# Altium project IR_SCOOTER.PrjPcb (part 1 of 4)
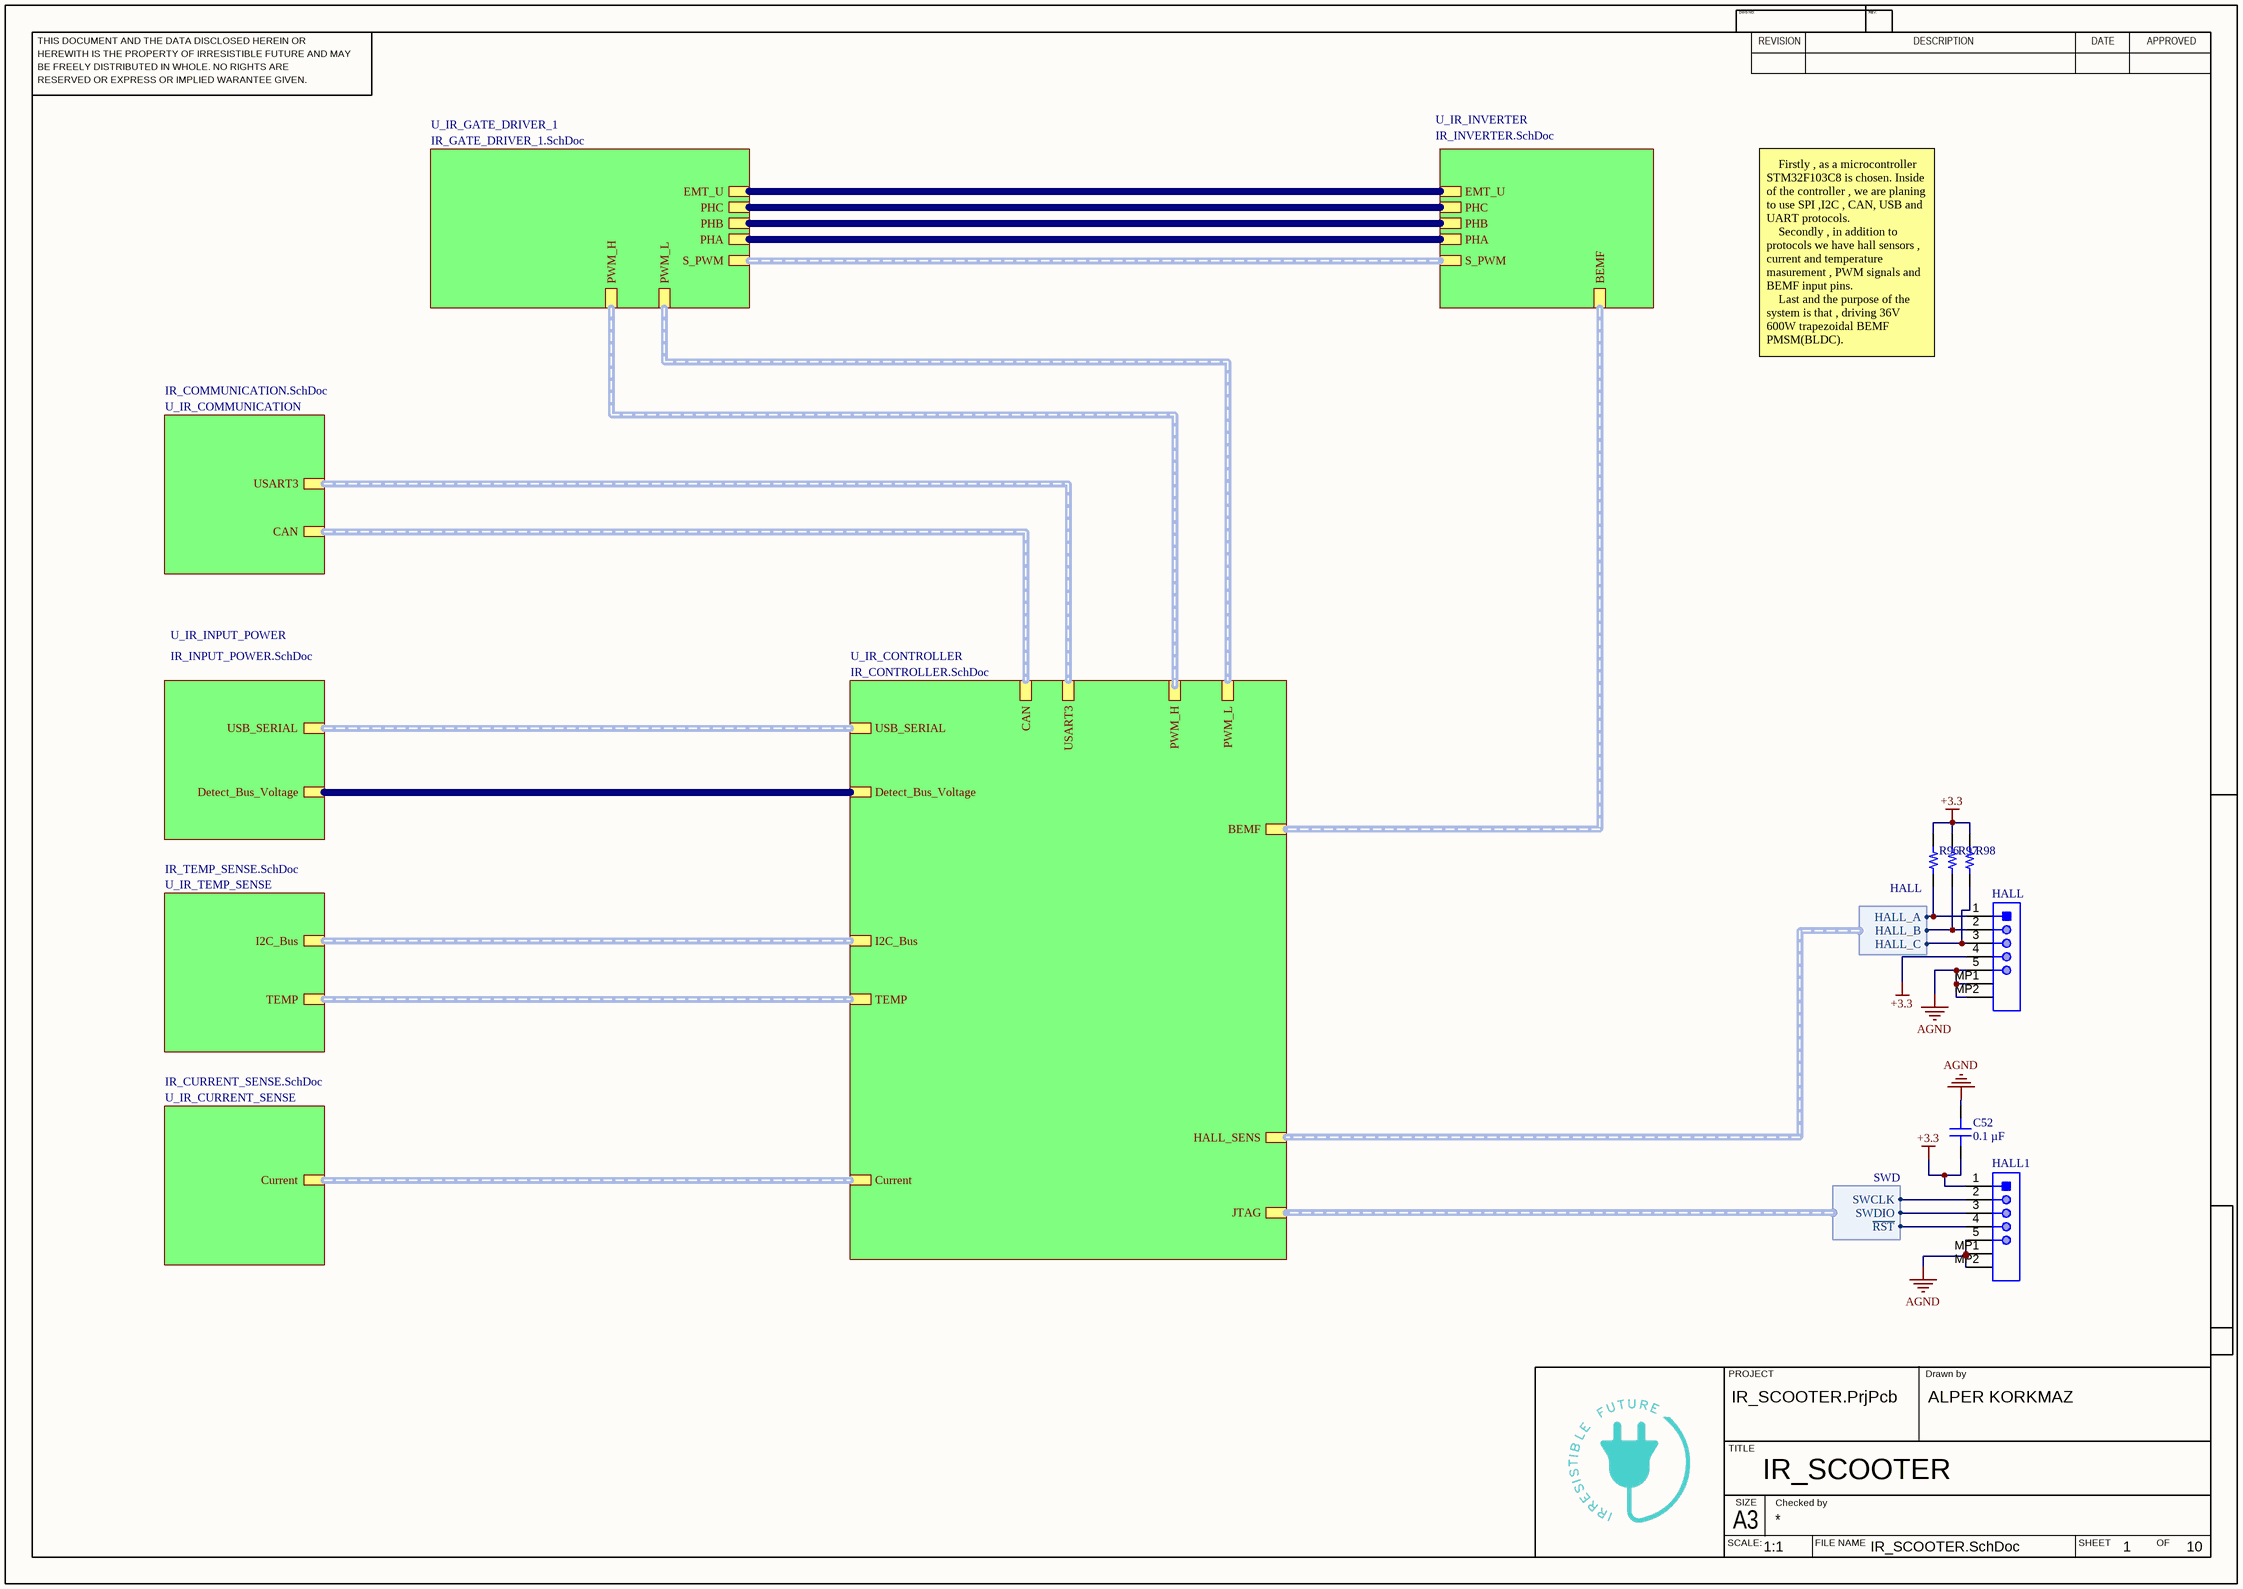
[diagram p0: IR_SCOOTER.SchDoc]
8 sheets, 219 parts. Net scope: hierarchical (ports join the sheet entries above them; power ports are global).
Board file: IR_SCOOTER.PcbDoc
Sheets:
  IR_SCOOTER.SchDoc
    U_IR_CONTROLLER = IR_CONTROLLER.SchDoc
    U_IR_TEMP_SENSE = IR_TEMP_SENSE.SchDoc
    U_IR_CURRENT_SENSE = IR_CURRENT_SENSE.SchDoc
    U_IR_INPUT_POWER = IR_INPUT_POWER.SchDoc
    U_IR_COMMUNICATION = IR_COMMUNICATION.SchDoc
    U_IR_GATE_DRIVER_1 = IR_GATE_DRIVER_1.SchDoc
    U_IR_INVERTER = IR_INVERTER.SchDoc

## Sheet IR_SCOOTER.SchDoc: IR_SCOOTER
size 420 x 297 mm; Engineer: ALPER KORKMAZ; SheetNumber: 1; SheetTotal: 8; SHEET: 1

### Parts
C52  0.1 µF  [CAP 0805_2012]
HALL  53261-0571  [MOLX-52361-0571-5_V]  (value not drawn)
HALL1  53261-0571  [MOLX-52361-0571-5_V]  (value not drawn)
R96  10 kOhms  [RES 0603_1608]  (value not drawn)
R97  10 kOhms  [RES 0603_1608]  (value not drawn)
R98  10 kOhms  [RES 0603_1608]  (value not drawn)

### Sub-sheets
U_IR_COMMUNICATION = IR_COMMUNICATION.SchDoc: USART3 (harness SERIAL), CAN (harness CAN)
U_IR_CONTROLLER = IR_CONTROLLER.SchDoc: HALL_SENS (harness HALL), PWM_H (harness PWM_H), JTAG (harness SWD), BEMF (harness BEMF), USB_SERIAL (harness USB), PWM_L (harness PWM_L), I2C_Bus (harness I2C), Current (harness Current), CAN (harness CAN), USART3 (harness SERIAL), TEMP (harness TEMP), Detect_Bus_Voltage
U_IR_CURRENT_SENSE = IR_CURRENT_SENSE.SchDoc: Current (harness Current)
U_IR_GATE_DRIVER_1 = IR_GATE_DRIVER_1.SchDoc: S_PWM (harness S_PWM), PHA, PHB, PHC, EMT_U, PWM_H (harness PWM_H), PWM_L (harness PWM_L)
U_IR_INPUT_POWER = IR_INPUT_POWER.SchDoc: Detect_Bus_Voltage, USB_SERIAL (harness USB)
U_IR_INVERTER = IR_INVERTER.SchDoc: BEMF (harness BEMF), S_PWM (harness S_PWM), PHA, PHB, PHC, EMT_U
U_IR_TEMP_SENSE = IR_TEMP_SENSE.SchDoc: I2C_Bus (harness I2C), TEMP (harness TEMP)

### Harnesses
SWD: SWCLK, SWDIO, ~{RST}
HALL: HALL_C, HALL_B, HALL_A

### Nets
+3.3: C52.1 HALL.4 HALL1.1 R96.2 R97.2 R98.2
AGND: C52.2 HALL.5 HALL.MP1 HALL.MP2 HALL1.5 HALL1.MP1 HALL1.MP2
Detect_Bus_Voltage: sheet U_IR_CONTROLLER/Detect_Bus_Voltage, sheet U_IR_INPUT_POWER/Detect_Bus_Voltage
EMT_U: sheet U_IR_GATE_DRIVER_1/EMT_U, sheet U_IR_INVERTER/EMT_U
PHA: sheet U_IR_GATE_DRIVER_1/PHA, sheet U_IR_INVERTER/PHA
PHB: sheet U_IR_GATE_DRIVER_1/PHB, sheet U_IR_INVERTER/PHB
PHC: sheet U_IR_GATE_DRIVER_1/PHC, sheet U_IR_INVERTER/PHC
~{RST}: HALL1.4 ; sheet U_IR_CONTROLLER/JTAG.~{RST}
NetHALL1_2: HALL1.2 ; sheet U_IR_CONTROLLER/JTAG.SWCLK
NetHALL1_3: HALL1.3 ; sheet U_IR_CONTROLLER/JTAG.SWDIO
NetHALL_1: HALL.1 R96.1 ; sheet U_IR_CONTROLLER/HALL_SENS.HALL_A
NetHALL_2: HALL.2 R97.1 ; sheet U_IR_CONTROLLER/HALL_SENS.HALL_B
NetHALL_3: HALL.3 R98.1 ; sheet U_IR_CONTROLLER/HALL_SENS.HALL_C

### Buses and harness runs
harness sheet U_IR_COMMUNICATION/CAN = sheet U_IR_CONTROLLER/CAN
harness sheet U_IR_COMMUNICATION/USART3 = sheet U_IR_CONTROLLER/USART3
harness sheet U_IR_CONTROLLER/BEMF = sheet U_IR_INVERTER/BEMF
harness sheet U_IR_CONTROLLER/Current = sheet U_IR_CURRENT_SENSE/Current
harness sheet U_IR_CONTROLLER/I2C_Bus = sheet U_IR_TEMP_SENSE/I2C_Bus
harness sheet U_IR_CONTROLLER/PWM_H = sheet U_IR_GATE_DRIVER_1/PWM_H
harness sheet U_IR_CONTROLLER/PWM_L = sheet U_IR_GATE_DRIVER_1/PWM_L
harness sheet U_IR_CONTROLLER/TEMP = sheet U_IR_TEMP_SENSE/TEMP
harness sheet U_IR_CONTROLLER/USB_SERIAL = sheet U_IR_INPUT_POWER/USB_SERIAL
harness sheet U_IR_GATE_DRIVER_1/S_PWM = sheet U_IR_INVERTER/S_PWM

### Notes on the sheet
- Firstly , as a microcontroller STM32F103C8 is chosen. Inside of the controller , we are planing to use SPI ,I2C , CAN, USB and UART protocols.
  Secondly , in addition to protocols we have hall sensors , current and temperature masurement , PWM signals and BEMF input pins.
  Last and the purpose of the system is that , driving 36V 600W trapezoidal BEMF PMSM(BLDC).
- THIS DOCUMENT AND THE DATA DISCLOSED HEREIN OR
- HEREWITH IS THE PROPERTY OF IRRESISTIBLE FUTURE AND MAY
- DWG NO:
- REVISION
- REV:
- DESCRIPTION
- DATE
- APPROVED
- BE FREELY DISTRIBUTED IN WHOLE. NO RIGHTS ARE
- RESERVED OR EXPRESS OR IMPLIED WARANTEE GIVEN.
- PROJECT
- Drawn by
- TITLE
- SCALE:
- A3
- SIZE
- Checked by
- FILE NAME
- SHEET
- OF
- 1:1
- 10

### Library data of the parts
C52 = HMK212BJ104KG-T: CAP CER 0.1UF 100V X5R 0805; manufacturer: Taiyo Yuden; Tolerance: ±10%; Part Number: HMK212BJ104KG-T; Value: 0.1 µF; Applications: SMPS Filtering; Capacitance: 0.1 µF; componentlink1description: Datasheet; componentlink1url: https://www.yuden.co.jp/productdata/catalog/mlcc01_e.pdf; componentlink2description: DigiKey Link; componentlink2url: https://www.digikey.com/en/products/detail/taiyo-yuden/HMK212BJ104KG-T/4970697; Device Package: 0805 (2012 Metric); Features: High Voltage; lastupdated: 23.05.2022 12:58:06; Lifecycle Status: Active; Minimum Order: 1; Mounting Type: Surface Mount, MLCC; Operating Temperature: -55°C ~ 85°C; Package / Case: 0805 (2012 Metric); packaging: TapeAndReel; partid: 3711; Part Status: Active; price: 0.04; series: M; Size / Dimension: 0.079" L x 0.049" W (2.00mm x 1.25mm); Supplier 1: DigiKey; Supplier Part Number 1: 587-5863-1-ND; Temperature Coefficient: X5R; Thickness (Max): 0.053" (1.35mm); Voltage - Rated: 100V
HALL HALL1 = CMP-2000-05249-1: Male Header, Pitch 1.25 mm, 1 x 5 Position, Height 3.4 mm, RoHS, Tape and Reel; Brand: Molex; Mounting Angle: Right; Number of Positions: 5; Voltage Rating: 125V; Current Rating: 1A; Pitch: 1.25mm; Datasheet Version: Rev. D, 04/2004; Housing Material: Thermoplastic; Series: 53261; RoHS: Details; Product Category: Headers&WireHousings; Datasheet URL: http://datasheet.octopart.com/532610571-Molex-datasheet-8343080.pdf; Manufacturer URL: http://www.molex.com/; Contact Material: PhosphorBronze; Tradename: PicoBlade; Number of Rows: 1; Product Type: Headers; Manufacturer: Molex; Type: Shrouded; Termination Style: SMD; Mounting Style: SMD/SMT; Factory Pack Quantity: 1000; Contact Plating: Tin; Packaging: Reel; Number of Positions / Contacts: 5
R96-R98 = RNCS0603BKE10K0: RES 10K OHM 0.1% 1/16W 0603; Manufacturer: Stackpole Electronics Inc; Power (Watts): 0.063W, 1/16W; Temperature Coefficient: ±25ppm/°C; Part Number: RNCS0603BKE10K0; Value: 10 kOhms; ComponentLink1Description: Datasheet; ComponentLink1URL: https://www.seielect.com/catalog/sei-rncs_rnch.pdf; ComponentLink2Description: DigiKey Link; ComponentLink2URL: https://www.digikey.com/en/products/detail/stackpole-electronics-inc/RNCS0603BKE10K0/1708836; Composition: Thin Film; Device Package: 0603 (1608 Metric); Features: Anti-Corrosive, Automotive AEC-Q200, Moisture Resistant; Height - Seated (Max): 0.022" (0.55mm); LastUpdated: 30.06.2022 22:25:20; Lifecycle Status: Active; Minimum Order: 1; Number of Terminations: 2; Operating Temperature: -55°C ~ 155°C; Package / Case: 0603 (1608 Metric); Packaging: TapeAndReel; PartId: 4838; Part Status: Active; Price: 0.08; Ratings: AEC-Q200; Resistance: 10 kOhms; Series: RNCS; Size / Dimension: 0.061" L x 0.031" W (1.55mm x 0.80mm); Supplier 1: DigiKey; Supplier Part Number 1: RNCS0603BKE10K0CT-ND; Supplier Device Package: 0603; Tolerance: ±0.1%

## Sheet IR_CONTROLLER.SchDoc: IR_CONTROLLER
size 420 x 297 mm; Engineer: ALPER KORKMAZ; SheetNumber: 3; SheetTotal: 8; SHEET: 3
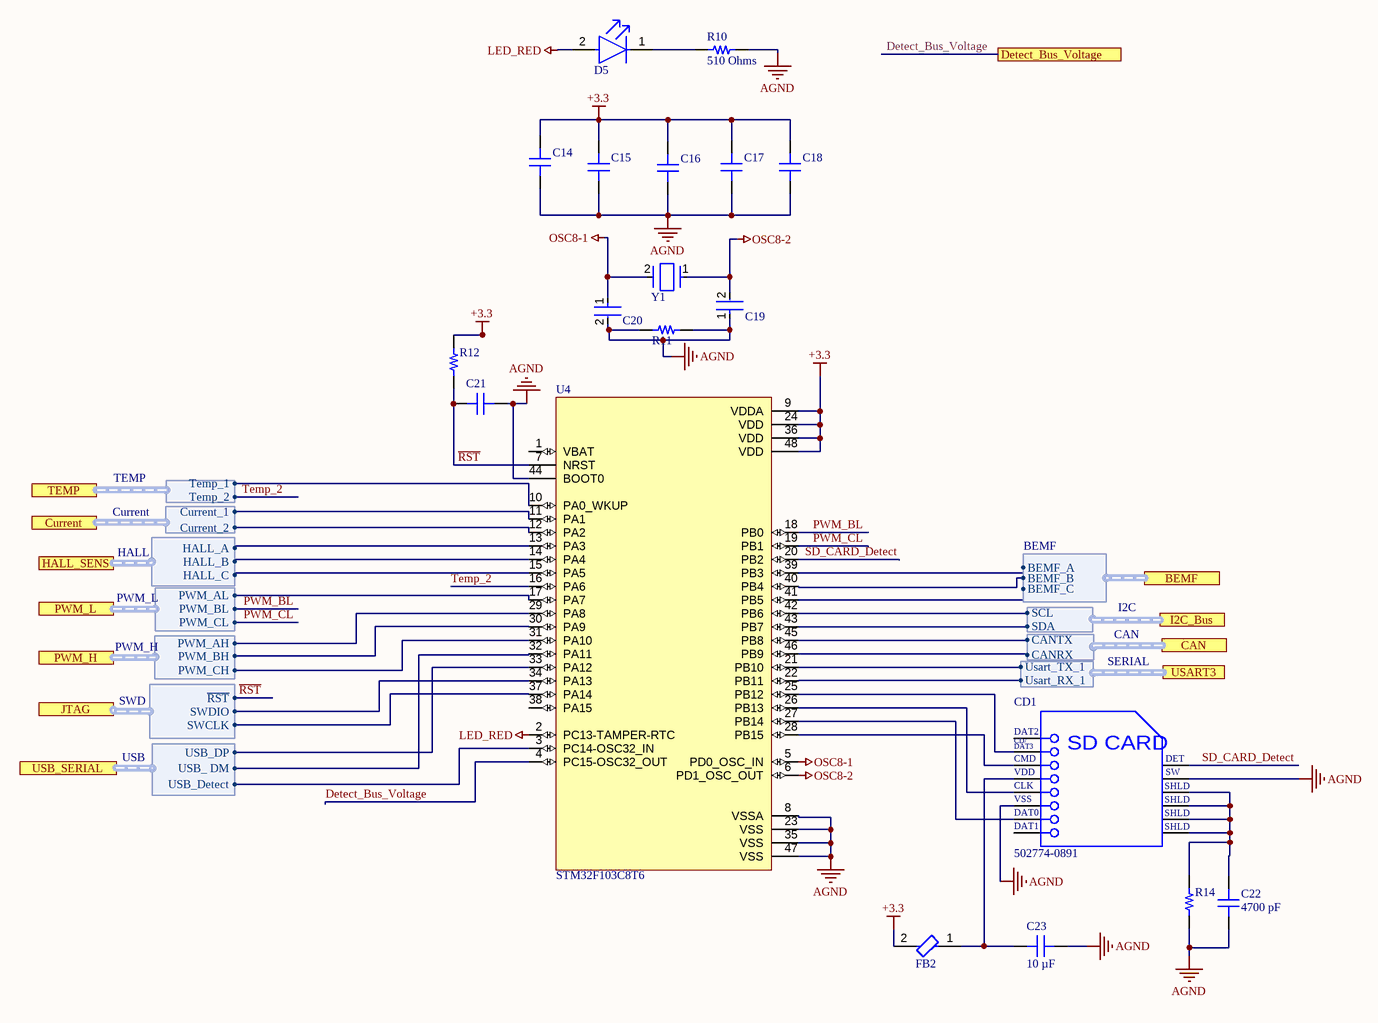
[diagram p1: IR_CONTROLLER.SchDoc]

### Parts
C14  0.1 µF  [CAP 0603_1608]  (value not drawn)
C15  0.1 µF  [CAP 0603_1608]  (value not drawn)
C16  0.1 µF  [CAP 0603_1608]  (value not drawn)
C17  0.1 µF  [CAP 0603_1608]  (value not drawn)
C18  10 µF  [CAP 0603_1608]  (value not drawn)
C19  10pF  [FP-C0805C-DN-MFG]  (value not drawn)
C20  10pF  [FP-C0805C-DN-MFG]  (value not drawn)
C21  100 nF  [CAP 0603_1608]  (value not drawn)
C22  4700 pF  [CAP 0805_2012]
C23  10 µF  [CAP 0603_1608]
CD1  502774-0891  [MOLX-502774-0891_V]
D5  CMD15-21VRD/TR8  [FP-CMD15-21-MFG]  (value not drawn)
FB2  BLM18PG330SN1D  [FP-BLM18-0_15-t0_8-d1_2-MFG]  (value not drawn)
R10  510 Ohms  [RES 0603_1608]
R11  1M Ohms  [RES 0603_1608]  (value not drawn)
R12  4.7 kOhms  [RES 0603_1608]  (value not drawn)
R14  1 MOhms  [RES 0603_1608]  (value not drawn)
U4  STM32F103C8T6  [QFN48-(7mmX7mm)]
Y1  ABM3-8.000MHZ-D2Y-T  [FP-ABM3-MFG]  (value not drawn)

### Ports
BEMF (harness BEMF, see 1[4C], 4[5C]), CAN (harness CAN, see 1[3B], 6[1C]), Current (harness Current, see 1[3C], 8[3A]), Detect_Bus_Voltage (see 1[3B], 2[6B]), HALL_SENS (harness HALL, see 1[4C]), I2C_Bus (harness I2C, see 1[3C], 7[2A]), JTAG (harness SWD, see 1[4D]), PWM_H (harness PWM_H, see 1[4B], 5[5C]), PWM_L (harness PWM_L, see 1[4B], 5[5C]), TEMP (harness TEMP, see 1[3C], 7[3A]), USART3 (harness SERIAL, see 1[3B], 6[1A]), USB_SERIAL (harness USB, see 1[3B], 2[5C])

### Harnesses
HALL: HALL_C, HALL_B, HALL_A
SWD: SWCLK, SWDIO, ~{RST}
PWM_H: PWM_CH, PWM_BH, PWM_AH
BEMF: BEMF_A, BEMF_B, BEMF_C
USB: USB_Detect, USB_ DM, USB_DP
PWM_L: PWM_CL, PWM_BL, PWM_AL
I2C: SDA, SCL
Current: Current_1, Current_2
CAN: CANRX, CANTX
SERIAL: Usart_RX_1, Usart_TX_1
TEMP: Temp_1, Temp_2

### Nets
+3.3: C14.2 C15.2 C16.2 C17.2 C18.2 FB2.2 R12.2 U4.9(VDDA) U4.24(VDD) U4.36(VDD) U4.48(VDD)
AGND: C14.1 C15.1 C16.1 C17.1 C18.1 C19.1 C20.2 C21.1 C22.1 C23.2 CD1.6(VSS) CD1.10(SWITCH) R10.2 R11.1 R11.2 R14.1 U4.8(VSSA) U4.23(VSS) U4.35(VSS) U4.44(BOOT0) U4.47(VSS)
LED_RED: D5.2(A) U4.2(PC13-TAMPER-RTC)
OSC8-1: C20.1 U4.5(PD0_OSC_IN) Y1.2
OSC8-2: C19.2 U4.6(PD1_OSC_OUT) Y1.1
Current_1: U4.11(PA1) ; port Current.Current_1
Current_2: U4.12(PA2) ; port Current.Current_2
Detect_Bus_Voltage: U4.4(PC15-OSC32_OUT) ; port Detect_Bus_Voltage
GPIO_ALERT: U4.10(PA0_WKUP) ; port TEMP.Temp_1
PWM_A_BOT: U4.17(PA7) ; port PWM_L.PWM_AL
PWM_A_TOP: U4.29(PA8) ; port PWM_H.PWM_AH
PWM_B_TOP: U4.30(PA9) ; port PWM_H.PWM_BH
PWM_BL: U4.18(PB0) ; port PWM_L.PWM_BL  [project net PWM_B_BOT]
PWM_C_TOP: U4.31(PA10) ; port PWM_H.PWM_CH
PWM_CL: U4.19(PB1) ; port PWM_L.PWM_CL  [project net PWM_C_BOT]
~{RST}: C21.2 R12.1 U4.7(NRST) ; port JTAG.~{RST}
SD_CARD_Detect: CD1.9(DETECT) U4.20(PB2)
Temp_2: U4.16(PA6) ; port TEMP.Temp_2
NetC12_2: U4.3(PC14-OSC32_IN) ; port USB_SERIAL.USB_Detect
NetC22_2: C22.2 CD1.11(SHLD) CD1.12(SHLD) CD1.13(SHLD) CD1.14(SHLD) R14.2
NetC23_1: C23.1 CD1.4(VDD) FB2.1
NetCD1_2: CD1.2(CD/DAT3) U4.25(PB12)
NetCD1_3: CD1.3(CMD) U4.28(PB15)
NetCD1_5: CD1.5(CLK) U4.26(PB13)
NetCD1_7: CD1.7(DAT0) U4.27(PB14)
NetD5_1: D5.1(C) R10.1
NetHALL1_2: U4.37(PA14) ; port JTAG.SWCLK
NetHALL1_3: U4.34(PA13) ; port JTAG.SWDIO
NetHALL_1: U4.13(PA3) ; port HALL_SENS.HALL_A
NetHALL_2: U4.14(PA4) ; port HALL_SENS.HALL_B
NetHALL_3: U4.15(PA5) ; port HALL_SENS.HALL_C
NetR27_2: U4.39(PB3) ; port BEMF.BEMF_A
NetR32_2: U4.40(PB4) ; port BEMF.BEMF_B
NetR37_2: U4.41(PB5) ; port BEMF.BEMF_C
NetR69_1: U4.21(PB10) ; port USART3.Usart_TX_1
NetR74_1: U4.46(PB9) ; port CAN.CANRX
NetR75_1: U4.45(PB8) ; port CAN.CANTX
NetR81_1: U4.43(PB7) ; port I2C_Bus.SDA
NetR82_1: U4.42(PB6) ; port I2C_Bus.SCL
NetU3_4: U4.33(PA12) ; port USB_SERIAL.USB_DP
NetU3_6: U4.32(PA11) ; port USB_SERIAL.USB_ DM
NetU4_22: U4.22(PB11) ; port USART3.Usart_RX_1

Not connected (* = marked no-connect by the designer): CD1 1(DAT2) 8(DAT1); U4 1(VBAT) 38(PA15)

### Notes on the sheet
- THIS DOCUMENT AND THE DATA DISCLOSED HEREIN OR
- HEREWITH IS THE PROPERTY OF IRRESISTIBLE FUTURE AND MAY
- DWG NO:
- REVISION
- REV:
- DESCRIPTION
- DATE
- APPROVED
- BE FREELY DISTRIBUTED IN WHOLE. NO RIGHTS ARE
- RESERVED OR EXPRESS OR IMPLIED WARANTEE GIVEN.
- PROJECT
- Drawn by
- TITLE
- SCALE:
- A3
- SIZE
- Checked by
- FILE NAME
- SHEET
- OF
- 1:1
- 10
- (in symbol CMP-2000-05248-1) CD/; DAT3; SD CARD; DET; SW

### Library data of the parts
C14-C17 = CS0603KRX7R7BB104: CAP CER 0.1UF 16V X7R 0603; Part Number: CS0603KRX7R7BB104; Value: 0.1 µF
C18 C21 = GRM188C80E106ME47D: CAP CER 10UF 2.5V X6S 0603; Part Number: GRM188C80E106ME47D
  C18: Value: 10 µF
  C21: Value: 100 nF
C19 C20 = CMP-2007-00219-2: Capacitor; Ceramic; Cap 10 pF; Tol 5%; Vol-Rtg 50 VDC; SMT; 0805; COG (NPO); Tape&Reel; Manufacturer Part Number: C0805C100J5GACTU; Manufacturer: KEMET; Temperature Coefficient: 30ppm/°C; Voltage Rating: 50 V; Tolerance: 0.05; Temperature Characteristic: C0G; RoHS: TRUE; Mouser Description: KEMET - C0805C100J5GACTU - CAP, MLCC, C0G/NP0, 10PF, 50V, 0805; Temperature Range High: +125°C; Octopart: https://octopart.com/c0805c100j5gactu-kemet-104357; Automotive: No; Device Class L1: Passive Components; Temperature Range Low: -55°C; Value: 10 pF; Device Class L3: Ceramic Capacitors; Material: Ceramic; Device Class L2: Capacitors; Lead Free: Yes; Category: Cap; Ipc Land Pattern Name: CAPC200125X78; ComponentLink2Description: Datasheet; ComponentLink2URL: https://content.kemet.com/datasheets/KEM_C1003_C0G_SMD.pdf; Digikey Description: Capacitor; Ceramic; Cap 10 pF; Tol 5%; Vol-Rtg 50 VDC; SMT; 0805; COG (NPO); Tape&Reel; Temperature: -55°C to +125°C; Height: 0.88mm; Capacitance: 10 pF; Package: C0805C-DN
C22 = C0805C472K5RACAUTO: CAP CER 4700PF 50V X7R 0805; manufacturer: KEMET; Tolerance: ±10%; Part Number: C0805C472K5RACAUTO; Value: 4700 pF; Applications: Automotive, Bypass, Decoupling; Capacitance: 4700 pF; componentlink1description: Datasheet; componentlink1url: https://api.kemet.com/component-edge/download/datasheet/C0805C472K5RACAUTO.pdf; componentlink2description: DigiKey Link; componentlink2url: https://www.digikey.com/en/products/detail/kemet/C0805C472K5RACAUTO/3314962; Device Package: 0805 (2012 Metric); lastupdated: 13.07.2022 13:50:26; Lifecycle Status: Active; Minimum Order: 1; Mounting Type: Surface Mount, MLCC; Operating Temperature: -55°C ~ 125°C; Package / Case: 0805 (2012 Metric); packaging: TapeAndReel; partid: 2514; Part Status: Active; price: 0.01; Ratings: AEC-Q200; series: SMD Auto X7R; Size / Dimension: 0.079" L x 0.049" W (2.00mm x 1.25mm); Supplier 1: DigiKey; Supplier Part Number 1: 399-6969-1-ND; Temperature Coefficient: X7R; Thickness (Max): 0.035" (0.88mm); Voltage - Rated: 50V
C23 = GRM188R60J106ME47D: CAP CER 10UF 6.3V X5R 0603; manufacturer: Murata Electronics; Tolerance: ±20%; Part Number: GRM188R60J106ME47D; Value: 10 µF; Applications: General Purpose; Capacitance: 10 µF; componentlink1description: Datasheet; componentlink1url: https://www.murata.com/~/media/webrenewal/support/library/catalog/products/capacitor/mlcc/c02e.ashx?la=en-us; componentlink2description: DigiKey Link; componentlink2url: https://www.digikey.com/en/products/detail/murata-electronics/GRM188R60J106ME47D/965910; Device Package: 0603 (1608 Metric); lastupdated: 13.07.2022 13:47:07; Lifecycle Status: Active; Minimum Order: 1; Mounting Type: Surface Mount, MLCC; Operating Temperature: -55°C ~ 85°C; Package / Case: 0603 (1608 Metric); packaging: TapeAndReel; partid: 2351; Part Status: Active; price: 0.03; series: GRM; Size / Dimension: 0.063" L x 0.031" W (1.60mm x 0.80mm); Supplier 1: DigiKey; Supplier Part Number 1: 490-3896-1-ND; Temperature Coefficient: X5R; Thickness (Max): 0.035" (0.90mm); Voltage - Rated: 6.3V
CD1 = CMP-2000-05248-1: Micro SD Memory Card Connector, 0.5 A, 10 V (DC), -25 to 85 degC, 8-Pin SMT, RoHS, Tape and Reel; Manufacturer: Molex; 3D Model: 502774-0891.stp; Online Catalog: microSD™Series; Number of Positions: 10(8+2); Card Type: SecureDigital-microSD™; Insertion, Removal Method: PushIn,PushOut; Other Names: WM24066DKR; Connector Type: ConnectorandEjector; Features: Switch; Family: MemoryConnectors-PCCardSockets; Manufacturer URL: http://www.molex.com/; Mounting Type: SurfaceMount,RightAngle; Contact Finish Thickness: 20µin(0.51µm); Standard Package: 1; Series: 502774; Ejector Side: -; Datasheet Version: Rev. D, 04/2004; Category: Connectors,Interconnects; Contact Finish: Gold; Datasheet URL: https://datasheet.ciiva.com/1104/1499551-1104671.pdf; RoHS Information: 502774-0891CertofCompliance; Mounting Feature: Reverse-Bottom; Packaging: Digi-Reel; Height Above Board: 0.071"(1.80mm); Catalog Drawings: 502774-0891
D5 = CMP-53976-000002-1: LED RED DIFFUSED 1206 SMD; Manufacturer: VCC; Led Orientation: Top View; Peak Emmision Wavelength: 640nm; Forward Current: 20mA; Power Dissipation: 105mW; Luminous Intensity: 4mcd; Forward Voltage: 2V; Reverse Voltage: 5V; Lead Free: Yes; Device Class L1: Optoelectronics; Package: CMD15-21; Temperature Range High: +85°C; Digikey Description: LED RED DIFFUSED 1206 SMD; Mouser Description: Standard LEDs - SMD RED DIFFUSED; Height: 1.3mm; ComponentLink2Description: Datasheet; Manufacturer Part Number: CMD15-21VRD/TR8; ComponentLink2URL: https://www.vcclite.com/wp-content/uploads/wpallimport/files/files/CMD1521SeriesRev1.pdf; Temperature: -40°C to +85°C; Automotive: No; Octopart: https://octopart.com/cmd15-21vrd%2Ftr8-vcc-26668835; Temperature Range Low: -40°C; Device Class L3: unset; Colour: Red; Category: Diode; Device Class L2: LEDs; RoHS: TRUE
FB2 = CMP-0686-00590-4: Chip Ferrite Bead, 0603, 33Ω @ 100MHz, 0.025Ω, 25%, 3A; Manufacturer Series: BLM18P; Shielding: Unshielded; Number of Functions: 1; Resistance: 25mR; ESR (Equivalent Series Resistance): 33R; Material: Steel; Packaging: Tape and Reel; Test Frequency: 100MHz; Length: 1.6mm; DC Current: 3A; Height: 0.8mm; Current Rating: 3A; Case/Package: 0603; Number of Lines: 1; Lead Free: Lead Free; RoHS Compliant: Yes; Max Current Rating: 3A; Case Code (Metric): 1608; Core Material: Ferrite; REACH SVHC: No SVHC; Min Operating Temperature: -55°C; Number of Pins: 2; DC Resistance (DCR): 25mR; Number of Circuits: 1; Series: BLM18P; Radiation Hardening: No; Max DC Current: 3A; Depth: 0.8mm; Terminal Finish: Tin; Package Quantity: 1; Case Code (Imperial): 0603; Impedance: 33R; Tolerance: 25%; Width: 0.8mm; Termination: SMD/SMT; DC Resistance-Max: 25mR; Max Operating Temperature: 125°C
R10 R11 = RNCS0603BKE10K0: RES 10K OHM 0.1% 1/16W 0603; Manufacturer: Stackpole Electronics Inc; Power (Watts): 0.063W, 1/16W; Resistance: 10 kOhms; Temperature Coefficient: ±25ppm/°C; Part Number: RNCS0603BKE10K0; ComponentLink1Description: Datasheet; ComponentLink1URL: https://www.seielect.com/catalog/sei-rncs_rnch.pdf; ComponentLink2Description: DigiKey Link; ComponentLink2URL: https://www.digikey.com/en/products/detail/stackpole-electronics-inc/RNCS0603BKE10K0/1708836; Composition: Thin Film; Device Package: 0603 (1608 Metric); Features: Anti-Corrosive, Automotive AEC-Q200, Moisture Resistant; Height - Seated (Max): 0.022" (0.55mm); LastUpdated: 23.05.2022 13:14:49; Lifecycle Status: Active; Minimum Order: 1; Number of Terminations: 2; Operating Temperature: -55°C ~ 155°C; Package / Case: 0603 (1608 Metric); Packaging: TapeAndReel; PartId: 4838; Part Status: Active; Price: 0.08; Ratings: AEC-Q200; Series: RNCS; Size / Dimension: 0.061" L x 0.031" W (1.55mm x 0.80mm); Supplier 1: DigiKey; Supplier Part Number 1: RNCS0603BKE10K0CT-ND; Supplier Device Package: 0603; Tolerance: ±0.1%
  R10: Value: 510 Ohms
  R11: Value: 1M Ohms
R12 = CPF0603B4K7E1: RES SMD 4.7K OHM 0.1% 1/16W 0603; Manufacturer: TE Connectivity Passive Product; Power (Watts): 0.063W, 1/16W; Temperature Coefficient: ±25ppm/°C; Part Number: CPF0603B4K7E1; Value: 4.7 kOhms; ComponentLink1Description: Datasheet; ComponentLink1URL: https://www.te.com/commerce/DocumentDelivery/DDEController?Action=srchrtrv&DocNm=1773200&DocType=DS&DocLang=English; ComponentLink2Description: DigiKey Link; ComponentLink2URL: https://www.digikey.com/en/products/detail/te-connectivity-passive-product/CPF0603B4K7E1/2381934; Composition: Thin Film; Device Package: 0603 (1608 Metric); Height - Seated (Max): 0.022" (0.55mm); LastUpdated: 30.06.2022 22:25:17; Lifecycle Status: Active; Minimum Order: 1; Number of Terminations: 2; Operating Temperature: -55°C ~ 155°C; Package / Case: 0603 (1608 Metric); Packaging: TapeAndReel; PartId: 5789; Part Status: Active; Price: 0.13; Resistance: 4.7 kOhms; Series: CPF, Neohm; Size / Dimension: 0.061" L x 0.031" W (1.55mm x 0.80mm); Supplier 1: DigiKey; Supplier Part Number 1: A103105CT-ND; Supplier Device Package: 0603; Tolerance: ±0.1%
R14 = RT0603BRD071ML: RES SMD 1M OHM 0.1% 1/10W 0603; Manufacturer: Yageo; Power (Watts): 0.1W, 1/10W; Temperature Coefficient: ±25ppm/°C; Part Number: RT0603BRD071ML; Value: 1 MOhms; ComponentLink1Description: Datasheet; ComponentLink1URL: https://www.yageo.com/upload/media/product/productsearch/datasheet/rchip/PYu-RT_1-to-0.01_RoHS_L_11.pdf; ComponentLink2Description: DigiKey Link; ComponentLink2URL: http://digikey.com/product-detail/en/yageo/RT0603BRD071ML/YAG4498CT-ND/6616654; Composition: Thin Film; Device Package: 0603 (1608 Metric); Height - Seated (Max): 0.022" (0.55mm); LastUpdated: 11.07.2022 15:05:15; Lifecycle Status: Active; Minimum Order: 1; Number of Terminations: 2; Operating Temperature: -55°C ~ 155°C; Package / Case: 0603 (1608 Metric); Packaging: TapeAndReel; PartId: 5503; Part Status: Active; Price: 0.03; Resistance: 1 MOhms; Series: RT; Size / Dimension: 0.063" L x 0.031" W (1.60mm x 0.80mm); Supplier 1: DigiKey; Supplier Part Number 1: YAG4498CT-ND; Supplier Device Package: 0603; Tolerance: ±0.1%
U4 = STM32F103C8T6: IC MCU 32-Bit 72MHz 64kB FLASH LQFP48; MF: STMicroelectronics; RAM Size: 20KB; Max Power Dissipation: 363mW; Interface: I2C,SPI,USB,CAN,IrDA,UART,USART,LIN; Number of I/Os: 37; Number of Timers/Counters: 4; Max Supply Voltage: 3.6V; Number of ADC Channels: 10; Min Supply Voltage: 2V; Oscillator Type: Internal; Number of Programmable I/O: 48; Data Bus Width: 32b; Number of Bits: 32; Watchdog Timer: Yes; Peripherals: POR,PWM,WDT,DMA,Temp Sensor,I2C; Core Architecture: ARM; Number of PWM Channels: 1; Number of SPI Channels: 2; Price: None; Package: LQFP-48 STMicroelectronics; Value: *; MP: STM32F103C8T6; Availability: Unavailable; Supplier 1: Digi-Key; Manufacturer: STMicroelectronics; Manufacturer Part Number: STM32F103C8T6; RoHS: Yes; Category: Microcontrollers; Pricing 1: 1=7,00000, 10=6,28800, 25=5,94440, 80=5,15175, 250=4,88756, 500=4,40320 (USD); Case/Package: LQFP; Number of Pins: 48; Min Operating Temperature: -40°C; Max Operating Temperature: 85°C; Frequency: 72MHz; Packaging: Tray; Package Quantity: 250; Density: 64KB; Memory Type: FLASH; Max Frequency: 72MHz; Memory Size: 64KB; Termination: SMD/SMT; Number of I2C Channels: 2; Address Bus Width: 32b; Length: 7mm; Width: 7.2mm; Height: 1.45mm; Radiation Hardening: No; Lead Free: Lead Free; REACH SVHC: No SVHC; ComponentLink1URL: https://datasheet.ciiva.com/15122/getdatasheetpartid-69880-15122076.pdf?src-supplier=Verical; ComponentLink1Description: https://datasheet.ciiva.com/15122/getdatasheetpartid-69880-15122076.pdf?src-supplier=Verical; ComponentLink2URL: https://datasheet.ciiva.com/26816/stm32f103c8t6-26816902.pdf?src-supplier=IIIC; ComponentLink2Description: https://datasheet.ciiva.com/26816/stm32f103c8t6-26816902.pdf?src-supplier=IIIC; ComponentLink3URL: https://datasheet.ciiva.com/16210/cd00161566-16210248.pdf?src-supplier=Future+Electronics; ComponentLink3Description: https://datasheet.ciiva.com/16210/cd00161566-16210248.pdf?src-supplier=Future+Electronics; ComponentLink4URL: https://datasheet.ciiva.com/14100/pustm-arm-microcont-stm32f103-en-14100508.pdf?src-supplier=Distrelec; ComponentLink4Description: https://datasheet.ciiva.com/14100/pustm-arm-microcont-stm32f103-en-14100508.pdf?src-supplier=Distrelec; ComponentLink5URL: https://datasheet.ciiva.com/8054/1730126-8054942.pdf?src-supplier=Element14; ComponentLink5Description: https://datasheet.ciiva.com/8054/1730126-8054942.pdf?src-supplier=Element14; ComponentLink6URL: https://datasheet.ciiva.com/48687/001075658-da-01-en-mcu-64kb-mem-stm32f103c8t6-lqfp-48-stm-48687589.pdf?src-supplier=Conrad; ComponentLink6Description: https://datasheet.ciiva.com/48687/001075658-da-01-en-mcu-64kb-mem-stm32f103c8t6-lqfp-48-stm-48687589.pdf?src-supplier=Conrad; Supplier Part Number 1: 497-6063-ND
Y1 = CMP-2000-05033-2: Crystal 8MHz ±20ppm 18pF SMD-2 5mm x 3.2mm; Series Resistance: 500R; Frequency Stability: 30ppm; ESR (Equivalent Series Resistance): 140R; Load Capacitance: 18pF; Height: 0.051inch; Tolerance: 20ppm; Depth: 3.2mm; Max Operating Temperature: 85°C; Frequency: 8MHz; Termination: SMD/SMT; Lead Free: Lead Free; Number of Pins: 2; Width: 3.2mm; RoHS Compliant: Yes; Resistor Type: Ceramic; Length: 5mm; Mount: Surface Mount; Case/Package: CSMD; Package Quantity: 1000; Radiation Hardening: No; Min Operating Temperature: -40°C; Packaging: Tape and Reel; Frequency Tolerance: 20ppm

## Sheet IR_TEMP_SENSE.SchDoc: IR_TEMP_SENSE
size 420 x 297 mm; Engineer: ALPER KORKMAZ; SheetNumber: 7; SheetTotal: 8; SHEET: 7
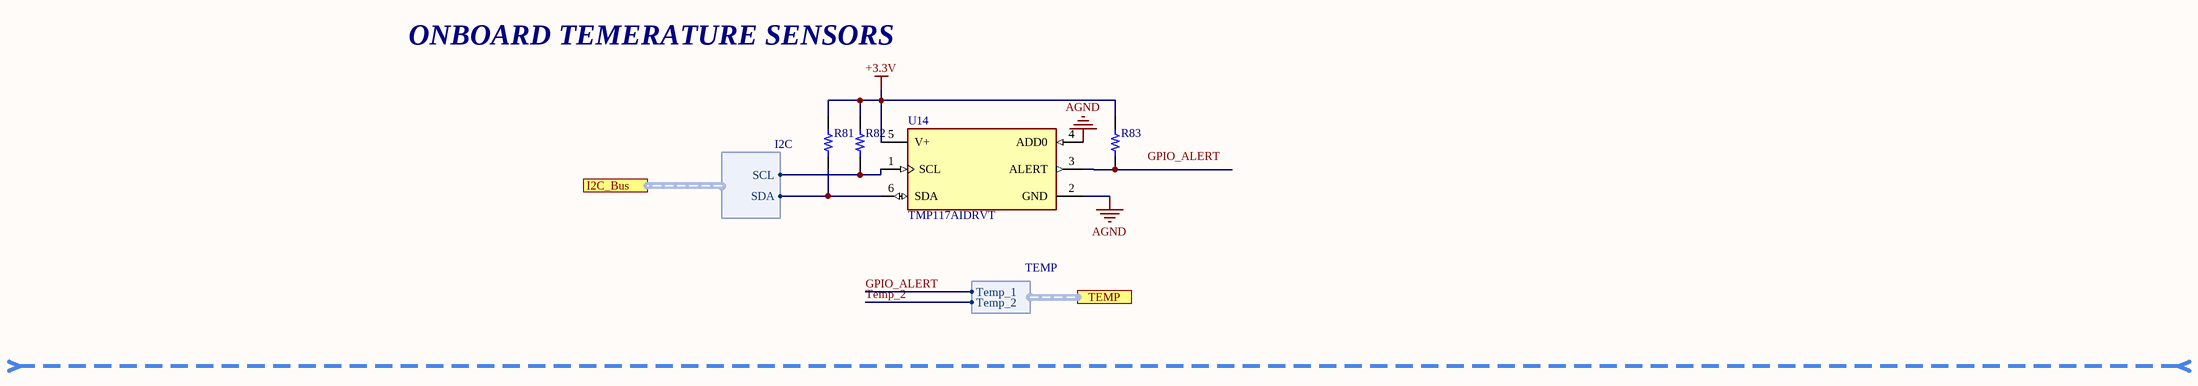
[diagram p2: IR_TEMP_SENSE.SchDoc]

### Parts
R81  (no value)  [RES 0603_1608]
R82  4.99 kOhms  [RES 0603_1608]  (value not drawn)
R83  4.99 kOhms  [RES 0603_1608]  (value not drawn)
U14  TMP117AIDRVT  [FP-DRV0006B-MFG]

### Ports
I2C_Bus (harness I2C, see 1[1C], 3[5B]), TEMP (harness TEMP, see 1[1C], 3[2B])

### Harnesses
I2C: SCL, SDA
TEMP: Temp_1, Temp_2

### Nets
+3.3V: R81.2 R82.2 R83.2 U14.5(V+)
AGND: U14.2(GND) U14.4(ADD0)
NetR81_1: R81.1 U14.6(SDA) ; port I2C_Bus.SDA
NetR82_1: R82.1 U14.1(SCL) ; port I2C_Bus.SCL
NetR83_1: R83.1 U14.3(ALERT)

### Notes on the sheet
- ONBOARD TEMERATURE SENSORS
- Labels drawn without touching a wire or pin: GPIO_ALERT
- THIS DOCUMENT AND THE DATA DISCLOSED HEREIN OR
- HEREWITH IS THE PROPERTY OF IRRESISTIBLE FUTURE AND MAY
- DWG NO:
- REVISION
- REV:
- DESCRIPTION
- DATE
- APPROVED
- BE FREELY DISTRIBUTED IN WHOLE. NO RIGHTS ARE
- RESERVED OR EXPRESS OR IMPLIED WARANTEE GIVEN.
- PROJECT
- Drawn by
- TITLE
- SCALE:
- A3
- SIZE
- Checked by
- FILE NAME
- SHEET
- OF
- 1:1
- 10

### Library data of the parts
R81 = RNCS0603BKE4K99: RES 4.99K OHM 0.1% 1/16W 0603; Manufacturer: Stackpole Electronics Inc; Power (Watts): 0.063W, 1/16W; Resistance: 4.99 kOhms; Temperature Coefficient: ±25ppm/°C; Part Number: RNCS0603BKE4K99; ComponentLink1Description: Datasheet; ComponentLink1URL: https://www.seielect.com/catalog/sei-rncs_rnch.pdf; ComponentLink2Description: DigiKey Link; ComponentLink2URL: https://www.digikey.com/en/products/detail/stackpole-electronics-inc/RNCS0603BKE4K99/1800030; Composition: Thin Film; Device Package: 0603 (1608 Metric); Features: Anti-Corrosive, Automotive AEC-Q200, Moisture Resistant; Height - Seated (Max): 0.022" (0.55mm); LastUpdated: 30.06.2022 22:25:20; Lifecycle Status: Active; Minimum Order: 1; Number of Terminations: 2; Operating Temperature: -55°C ~ 155°C; Package / Case: 0603 (1608 Metric); Packaging: TapeAndReel; PartId: 4844; Part Status: Active; Price: 0.08; Ratings: AEC-Q200; Series: RNCS; Size / Dimension: 0.061" L x 0.031" W (1.55mm x 0.80mm); Supplier 1: DigiKey; Supplier Part Number 1: RNCS0603BKE4K99CT-ND; Supplier Device Package: 0603; Tolerance: ±0.1%
R82 R83 = RNCS0603BKE4K99: RES 4.99K OHM 0.1% 1/16W 0603; Manufacturer: Stackpole Electronics Inc; Power (Watts): 0.063W, 1/16W; Temperature Coefficient: ±25ppm/°C; Part Number: RNCS0603BKE4K99; Value: 4.99 kOhms; ComponentLink1Description: Datasheet; ComponentLink1URL: https://www.seielect.com/catalog/sei-rncs_rnch.pdf; ComponentLink2Description: DigiKey Link; ComponentLink2URL: https://www.digikey.com/en/products/detail/stackpole-electronics-inc/RNCS0603BKE4K99/1800030; Composition: Thin Film; Device Package: 0603 (1608 Metric); Features: Anti-Corrosive, Automotive AEC-Q200, Moisture Resistant; Height - Seated (Max): 0.022" (0.55mm); LastUpdated: 30.06.2022 22:25:20; Lifecycle Status: Active; Minimum Order: 1; Number of Terminations: 2; Operating Temperature: -55°C ~ 155°C; Package / Case: 0603 (1608 Metric); Packaging: TapeAndReel; PartId: 4844; Part Status: Active; Price: 0.08; Ratings: AEC-Q200; Resistance: 4.99 kOhms; Series: RNCS; Size / Dimension: 0.061" L x 0.031" W (1.55mm x 0.80mm); Supplier 1: DigiKey; Supplier Part Number 1: RNCS0603BKE4K99CT-ND; Supplier Device Package: 0603; Tolerance: ±0.1%
U14 = CMP-04948-000053-1: SENSOR TEMP; Resolution: 16b; Output Type: I2C; Packaging: Tape and Reel; Min Operating Temperature: -55°C; RoHS Compliant: Yes; Mount: Surface Mount; Max Operating Temperature: 150°C

## Sheet IR_CURRENT_SENSE.SchDoc: IR_CURRENT_SENSE
size 420 x 297 mm; Engineer: ALPER KORKMAZ; SheetNumber: 8; SheetTotal: 8; SHEET: 8; OF: 8
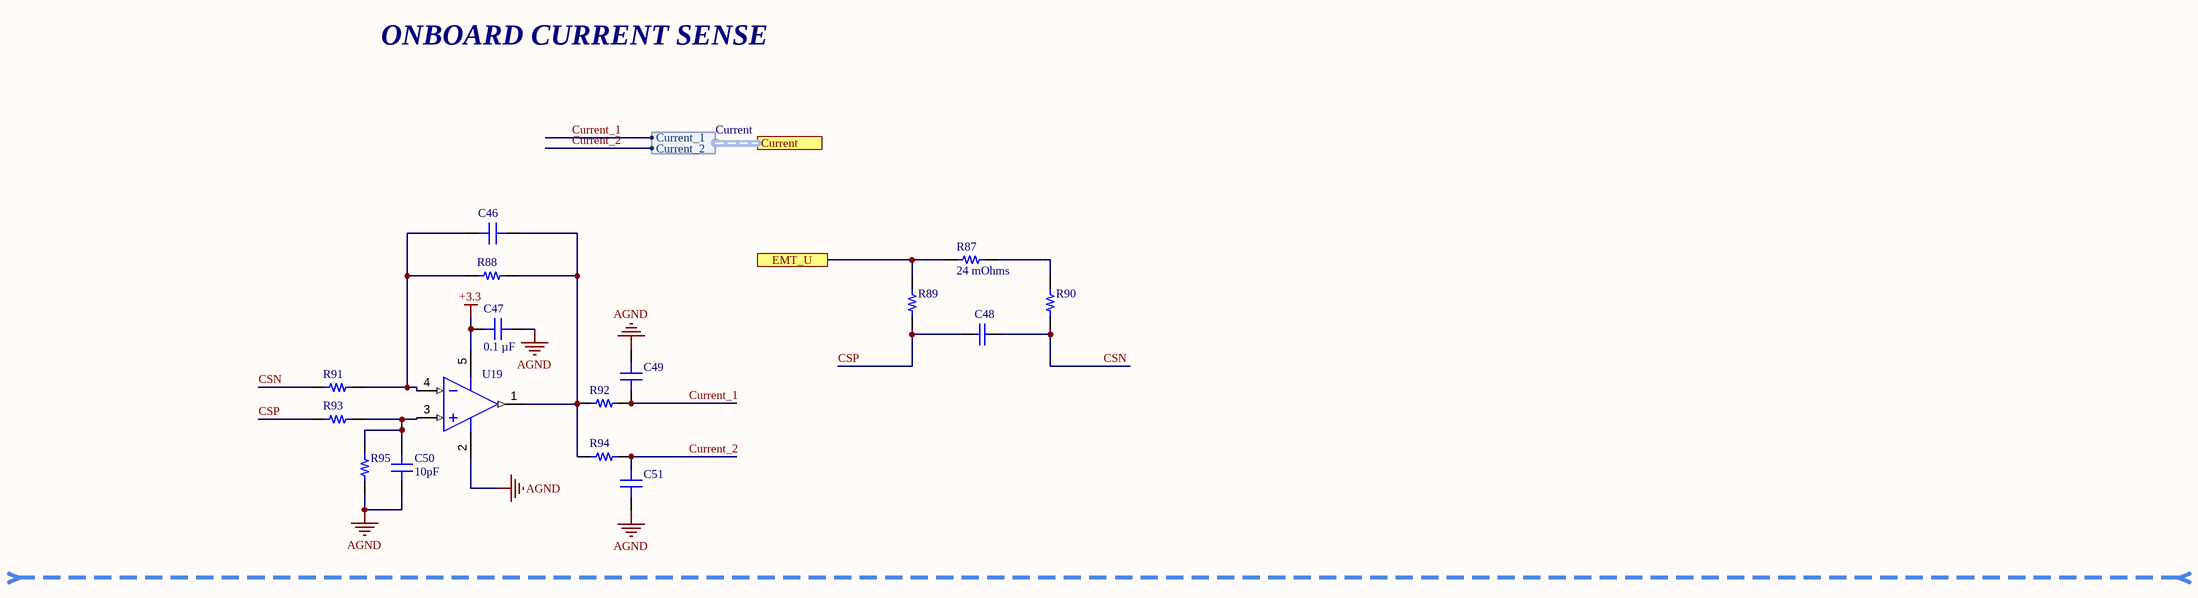
[diagram p3: IR_CURRENT_SENSE.SchDoc]

### Parts
C46  10pF  [CAP 0402_1005]  (value not drawn)
C47  0.1 µF  [CAP 0402_1005]
C48  GRM155R71H102KA01D  [CAPC1005X55X25ML5T10]  (value not drawn)
C49  1000 pF  [CAP 0402_1005]  (value not drawn)
C50  10pF  [CAP 0402_1005]
C51  1000 pF  [CAP 0402_1005]  (value not drawn)
R87  24 mOhms  [STACKPOLE CSR0805]
R88  20 kOhms  [RES 0402_1005]  (value not drawn)
R89  100 mOhms  [STACKPOLE CSR0805]  (value not drawn)
R90  100 mOhms  [STACKPOLE CSR0805]  (value not drawn)
R91  249 kOhms  [RES 0402_1005]  (value not drawn)
R92  100 Ohms  [RES 0402_1005]  (value not drawn)
R93  249 kOhms  [RES 0402_1005]  (value not drawn)
R94  100 Ohms  [RES 0402_1005]  (value not drawn)
R95  20 kOhms  [RES 0402_1005]  (value not drawn)
U19  OPA374AIDBVR  [DBV0005A_M]  (value not drawn)

### Ports
Current (harness Current, see 1[1C], 3[2B]), EMT_U

### Harnesses
Current: Current_1, Current_2

### Nets
+3.3: C47.1 U19.5(V+)
AGND: C47.2 C49.2 C50.2 C51.1 R95.1 U19.2(V-)
CSN: C48.2 R90.1 R91.1
CSP: C48.1 R89.1 R93.1
Current_1: C49.1 R92.2 ; port Current.Current_1
Current_2: C51.2 R94.2 ; port Current.Current_2
NetC46_1: C46.1 R88.1 R91.2 U19.4(IN-)
NetC46_2: C46.2 R88.2 R92.1 R94.1 U19.1(OUT)
NetC50_1: C50.1 R93.2 R95.2 U19.3(IN+)
NetR87_1: R87.1 R89.2 ; port EMT_U
NetR87_2: R87.2 R90.2

### Notes on the sheet
- ONBOARD CURRENT SENSE
- THIS DOCUMENT AND THE DATA DISCLOSED HEREIN OR
- HEREWITH IS THE PROPERTY OF IRRESISTIBLE FUTURE AND MAY
- DWG NO:
- REVISION
- REV:
- DESCRIPTION
- DATE
- APPROVED
- BE FREELY DISTRIBUTED IN WHOLE. NO RIGHTS ARE
- RESERVED OR EXPRESS OR IMPLIED WARANTEE GIVEN.
- PROJECT
- Drawn by
- TITLE
- SCALE:
- A3
- SIZE
- Checked by
- FILE NAME
- SHEET
- OF
- 1:1
- 10

### Library data of the parts
C46 C50 = 04025U100JAT2A: CAP CER 10PF 50V C0G/NP0 0402; manufacturer: AVX Corporation; Temperature Coefficient: C0G, NP0; Tolerance: ±5%; Part Number: 04025U100JAT2A; Value: 10pF; Applications: RF, Microwave, High Frequency; Capacitance: 10pF; componentlink1description: Datasheet; componentlink1url: http://datasheets.avx.com/U-Series.pdf; componentlink2description: DigiKey Link; componentlink2url: http://digikey.com/product-detail/en/avx-corporation/04025U100JAT2A/478-3831-1-ND/1118493; Device Package: 0402 (1005 Metric); Features: Ultra Low ESR; lastupdated: 8.02.2022 12:26:58; Lifecycle Status: Active; Minimum Order: 1; Mounting Type: Surface Mount, MLCC; Operating Temperature: -55°C ~ 125°C; Package / Case: 0402 (1005 Metric); packaging: TapeAndReel; partid: 1802; Part Status: Active; price: 0.02; series: U; Size / Dimension: 0.039" L x 0.020" W (1.00mm x 0.50mm); Supplier 1: DigiKey; Supplier Part Number 1: 478-3831-1-ND; Thickness (Max): 0.024" (0.60mm); Voltage - Rated: 50V
C47 = C0402C104K4RECAUTO: CAP CER 0402 0.1UF 16V X7R 10%; manufacturer: KEMET; Part Number: C0402C104K4RECAUTO; Value: 0.1 µF; Applications: Automotive, ESD Protection; Capacitance: 0.1 µF; componentlink1description: Datasheet; componentlink1url: https://api.kemet.com/component-edge/download/datasheet/C0402C104K4RECAUTO.pdf; componentlink2description: DigiKey Link; componentlink2url: https://www.digikey.com/en/products/detail/kemet/C0402C104K4RECAUTO/8563695; Device Package: 0402 (1005 Metric); lastupdated: 11.07.2022 14:40:14; Lifecycle Status: Active; Minimum Order: 1; Mounting Type: Surface Mount, MLCC; Operating Temperature: -55°C ~ 125°C; Package / Case: 0402 (1005 Metric); packaging: TapeAndReel; partid: 1731; Part Status: Active; price: 0.02; Ratings: AEC-Q200; series: ESD SMD Auto X7R; Size / Dimension: 0.039" L x 0.020" W (1.00mm x 0.50mm); Supplier 1: DigiKey; Supplier Part Number 1: 399-17167-1-ND; Temperature Coefficient: X7R; Thickness (Max): 0.022" (0.55mm); Tolerance: ±10%; Voltage - Rated: 16V
C48 = CMP-1662-00017-1: Chip Capacitor, 1 nF, +/- 10%, 50 V, -55 to 125 degC, 0402 (1005 Metric), RoHS, Tape and Reel; Case\/Package: 0402; Type (Capacitors): X7R; Voltage Rating (DC): 50 V; Capacitance: 1 nF; Width: 0.5 mm; Pins: 2; REACH SVHC: No SVHC; Length: 1 mm; Height: 0.5 mm; PackageDescription: 2-Pin Surface Mount Device, Body 1 x 0.5 mm; DatasheetVersion: 07/2016; Mount: Surface Mount; ComponentLink2Description: Datasheet; Tolerance: 10%; ComponentLink2URL: http://psearch.en.murata.com/capacitor/product/GRM155R71H102KA01%23.pdf; ComponentLink1URL: http://www.murata.com/; Case Code (Metric): 1005; Package Quantity: 10000; Min Operating Temperature: -55 degC; Max Operating Temperature: 125 degC; Voltage Rating: 50 V; ComponentLink1Description: Manufacturer URL; Packaging: Tape and Reel; Radiation Hardening: No; RoHSCompliant: true; PackageReference: 0402; Mounting Technology: Surface Mount; Case Code (Imperial): 0402
C49 C51 = UMK105CG102JVHF: CAP CER 1000PF 50V NP0 0402; manufacturer: Taiyo Yuden; Temperature Coefficient: C0G, NP0; Tolerance: ±5%; Part Number: UMK105CG102JVHF; Value: 1000 pF; Applications: Automotive; Capacitance: 1000 pF; componentlink1description: Datasheet; componentlink1url: https://ds.yuden.co.jp/TYCOMPAS/ut/detail?pn=UMK105CG102JVHF &u=M; componentlink2description: DigiKey Link; componentlink2url: https://www.digikey.com/en/products/detail/taiyo-yuden/UMK105CG102JVHF/4811103; Device Package: 0402 (1005 Metric); lastupdated: 11.07.2022 14:40:14; Lifecycle Status: Active; Minimum Order: 1; Mounting Type: Surface Mount, MLCC; Operating Temperature: -55°C ~ 125°C; Package / Case: 0402 (1005 Metric); packaging: TapeAndReel; partid: 1779; Part Status: Active; price: 0.02; Ratings: AEC-Q200; series: M; Size / Dimension: 0.039" L x 0.020" W (1.00mm x 0.50mm); Supplier 1: DigiKey; Supplier Part Number 1: 587-3737-1-ND; Thickness (Max): 0.022" (0.55mm); Voltage - Rated: 50V
R87 = ERJ-3BWJR024V: RES 0.024 OHM 5% 1/3W 0603; Manufacturer: Panasonic Electronic Components; Power (Watts): 0.333W, 1/3W; Temperature Coefficient: ±250ppm/°C; Part Number: ERJ-3BWJR024V; Package / Case: 0603 (1608 Metric); ComponentLink1Description: Datasheet; ComponentLink1URL: https://industrial.panasonic.com/cdbs/www-data/pdf/RDN0000/AOA0000C313.pdf; ComponentLink2Description: DigiKey Link; ComponentLink2URL: https://www.digikey.com/en/products/detail/panasonic-electronic-components/ERJ-3BWJR024V/5647514; Composition: Thick Film; Device Package: 0603 (1608 Metric); Features: Automotive AEC-Q200, Current Sense; Height - Seated (Max): 0.026" (0.65mm); LastUpdated: 11.07.2022 15:24:16; Lifecycle Status: Active; Minimum Order: 1; Number of Terminations: 2; Operating Temperature: -55°C ~ 155°C; Packaging: TapeAndReel; PartId: 97; Part Status: Active; Price: 0.08; Ratings: AEC-Q200; Resistance: 24 mOhms; Series: ERJ-3BW; Size / Dimension: 0.063" L x 0.031" W (1.60mm x 0.80mm); Supplier 1: DigiKey; Supplier Part Number 1: P17481CT-ND; Supplier Device Package: 0603; Tolerance: ±5%; Value: 24 mOhms
R88 R95 = CPF0402B20KE: RES SMD 20K OHM 0.1% 1/16W 0402; Manufacturer: TE Connectivity Passive Product; Power (Watts): 0.063W, 1/16W; Temperature Coefficient: ±25ppm/°C; Part Number: CPF0402B20KE; Value: 20 kOhms; ComponentLink1Description: Datasheet; ComponentLink1URL: https://www.te.com/commerce/DocumentDelivery/DDEController?Action=srchrtrv&DocNm=1773200&DocType=DS&DocLang=English; ComponentLink2Description: DigiKey Link; ComponentLink2URL: https://www.digikey.com/en/products/detail/te-connectivity-passive-product/CPF0402B20KE/2381755; Composition: Thin Film; Device Package: 0402 (1005 Metric); Height - Seated (Max): 0.014" (0.35mm); LastUpdated: 11.07.2022 14:58:16; Lifecycle Status: Active; Minimum Order: 1; Number of Terminations: 2; Operating Temperature: -55°C ~ 155°C; Package / Case: 0402 (1005 Metric); Packaging: TapeAndReel; PartId: 2476; Part Status: Active; Price: 0.10; Resistance: 20 kOhms; Series: CPF, Neohm; Size / Dimension: 0.039" L x 0.020" W (1.00mm x 0.50mm); Supplier 1: DigiKey; Supplier Part Number 1: A119914CT-ND; Supplier Device Package: 0402; Tolerance: ±0.1%
R89 R90 = 560050316001: RES 0.1 OHM 1% 1/4W 0603; Manufacturer: Würth Elektronik; Power (Watts): 0.25W, 1/4W; Temperature Coefficient: 250ppm/°C; Part Number: 560050316001; Package / Case: 0603 (1608 Metric); ComponentLink1Description: Datasheet; ComponentLink1URL: http://katalog.we-online.de/pbs/datasheet/560050316001.pdf; ComponentLink2Description: DigiKey Link; ComponentLink2URL: https://www.digikey.com/en/products/detail/würth-elektronik/560050316001/10071028; Composition: Thick Film; Device Package: 0603 (1608 Metric); Features: Current Sense; Height - Seated (Max): 0.022" (0.55mm); LastUpdated: 11.07.2022 15:24:16; Lifecycle Status: Active; Minimum Order: 1; Number of Terminations: 2; Operating Temperature: -55°C ~ 155°C; Packaging: TapeAndReel; PartId: 92; Part Status: Active; Price: 0.29; Resistance: 100 mOhms; Series: WRIS-KSKE; Size / Dimension: 0.063" L x 0.031" W (1.60mm x 0.80mm); Supplier 1: DigiKey; Supplier Part Number 1: 732-13797-1-ND; Supplier Device Package: 0603; Tolerance: ±1%; Value: 100 mOhms
R91 R93 = RP73PF1E249KBTD: RES 249K OHM 0.1% 1/10W 0402; Manufacturer: TE Connectivity Passive Product; Power (Watts): 0.1W, 1/10W; Temperature Coefficient: ±25ppm/°C; Part Number: RP73PF1E249KBTD; Value: 249 kOhms; ComponentLink1Description: Datasheet; ComponentLink1URL: https://www.te.com/commerce/DocumentDelivery/DDEController?Action=srchrtrv&DocNm=1773272&DocType=DS&DocLang=English; ComponentLink2Description: DigiKey Link; ComponentLink2URL: https://www.digikey.com/en/products/detail/te-connectivity-passive-product/RP73PF1E249KBTD/8261091; Composition: Thin Film; Device Package: 0402 (1005 Metric); Height - Seated (Max): 0.014" (0.35mm); LastUpdated: 11.07.2022 14:58:16; Lifecycle Status: Active; Minimum Order: 1; Number of Terminations: 2; Operating Temperature: -55°C ~ 155°C; Package / Case: 0402 (1005 Metric); Packaging: TapeAndReel; PartId: 2418; Part Status: Active; Price: 0.09; Resistance: 249 kOhms; Series: RP73, Holsworthy; Size / Dimension: 0.039" L x 0.020" W (1.00mm x 0.50mm); Supplier 1: DigiKey; Supplier Part Number 1: A127549CT-ND; Supplier Device Package: 0402; Tolerance: ±0.1%
R92 R94 = MCS0402PD1000DE500: RES 100 OHM 0.5% 1/5W 0402; Manufacturer: Vishay Beyschlag; Power (Watts): 0.2W, 1/5W; Temperature Coefficient: ±25ppm/°C; Part Number: MCS0402PD1000DE500; Value: 100 Ohms; ComponentLink1Description: Datasheet; ComponentLink1URL: http://www.vishay.com/docs/28916/mcxhp.pdf; ComponentLink2Description: DigiKey Link; ComponentLink2URL: http://digikey.com/product-detail/en/vishay-beyschlag/MCS0402PD1000DE500/749-1509-1-ND/7245027; Composition: Thin Film; Device Package: 0402 (1005 Metric); Features: Anti-Sulfur, Automotive AEC-Q200; Height - Seated (Max): 0.015" (0.37mm); LastUpdated: 11.07.2022 14:58:16; Lifecycle Status: Active; Minimum Order: 1; Number of Terminations: 2; Operating Temperature: -55°C ~ 175°C; Package / Case: 0402 (1005 Metric); Packaging: TapeAndReel; PartId: 2456; Part Status: Active; Price: 0.08; Ratings: AEC-Q200; Resistance: 100 Ohms; Series: MCS HP; Size / Dimension: 0.039" L x 0.020" W (1.00mm x 0.50mm); Supplier 1: DigiKey; Supplier Part Number 1: 749-1509-1-ND; Supplier Device Package: 0402; Tolerance: ±0.5%
U19 = CMP-0272-00957-3: 6.5 MHz, 585 uA, Rail-to-Rail I/O CMOS Operational Amplifier, 2.3 to 5.5 V, -40 to 125 degC, 5-pin SOT23 (DBV5), Green (RoHS & no Sb/Br); Manufacturer: Texas Instruments; Iq per channel(Max)(mA): 0.75; Rating: Catalog; Sub Family: High Output Current Amplifier (>=50mA), Low Input Bias Current Amp (<=10pA), Low Supply Voltage Amplifier (<=2.7V), Precision Amplifier; Offset Drift(Typ)(uV/C): 3; CMRR(Min)(dB): 80; GBW(Typ)(MHz): 6.5; Total Supply Voltage(Max)(+5V is 5, +/-5V is 10): 5.5; Total Supply Voltage(Min)(+5V is 5, +/-5V is 10): 2.3; Slew Rate(Typ)(V/us): 5; Packing: LARGE T&R; Number of Channels: 1; IIB(Max)(pA): 10; ComponentLink3URL: http://www.ti.com/litv/pdf/mpds018i; ComponentLink3Description: Package Specification; ComponentLink2Description: Datasheet; PackageVersion: 4073253-4/K, 03/2006; Code_JEDEC: MO-178; ComponentLink2URL: http://www.ti.com/lit/ds/symlink/opa374.pdf; PackageReference: DBV0005A; ComponentLink1Description: Manufacturer URL; PackageDescription: 5-Pin Plastic Small Outline, Body 1.6 x 2.9 mm, Pitch 0.95 mm; Mounting Technology: Surface Mount; DatasheetVersion: SBOS279E; ComponentLink1URL: http://www.ti.com/; Eco-Plan: Green (RoHS & no Sb/Br); Vio (25C)(Max)(mV): 5; PartNumber: OPA374AIDBVR